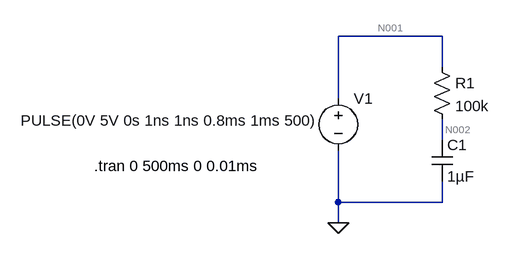
[diagram p0: schematic INCLASS_V002.asc]
INCLASS_V002.asc, the LTspice schematic file:
Version 4
SHEET 1 880 680
WIRE 256 -144 96 -144
WIRE 256 -96 256 -144
WIRE 96 -48 96 -144
WIRE 256 16 256 -16
WIRE 96 112 96 32
WIRE 256 112 256 80
WIRE 256 112 96 112
WIRE 96 144 96 112
FLAG 96 144 0
SYMBOL cap 240 16 R0
SYMATTR InstName C1
SYMATTR Value 1µF
SYMBOL res 240 -112 R0
SYMATTR InstName R1
SYMATTR Value 100k
SYMBOL voltage 96 -64 R0
WINDOW 3 -489 50 Left 2
WINDOW 123 0 0 Left 0
WINDOW 39 0 0 Left 0
SYMATTR InstName V1
SYMATTR Value PULSE(0V 5V 0s 1ns 1ns 0.8ms 1ms 500)
TEXT -280 56 Left 2 !.tran 0 500ms 0 0.01ms

The netlist it stands for:
* INCLASS_V002.asc
C1 N002 0 1µF
R1 N001 N002 100k
V1 N001 0 PULSE(0V 5V 0s 1ns 1ns 0.8ms 1ms 500)
.tran 0 500ms 0 0.01ms
.backanno
.end

* Results of the author's LTspice run, read from the files saved beside the schematic
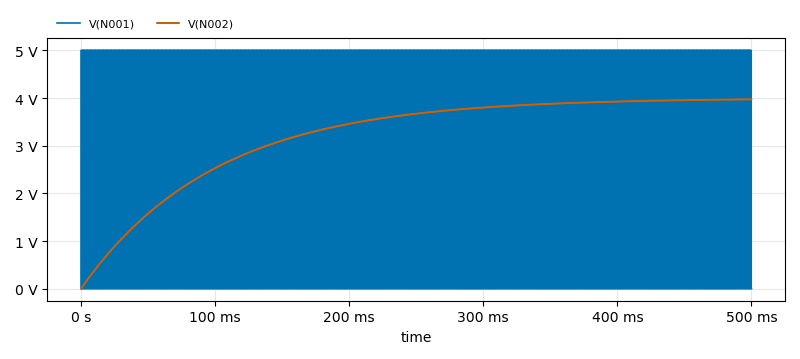
[diagram p1: Transient Analysis of INCLASS_V002.asc, plotted from the saved traces]
* Transient Analysis, 1 run:
*   V(N001): min 0 V, max 5 V, average 4 V, rms 4.472 V, last 0 V
*   V(N002): min 0 V, max 3.977 V, average 3.206 V, rms 3.354 V, last 3.969 V